# EAGLE design Callisto_Teknic_MSO_PBx4_v1p0 (EAGLE 9.6.2)
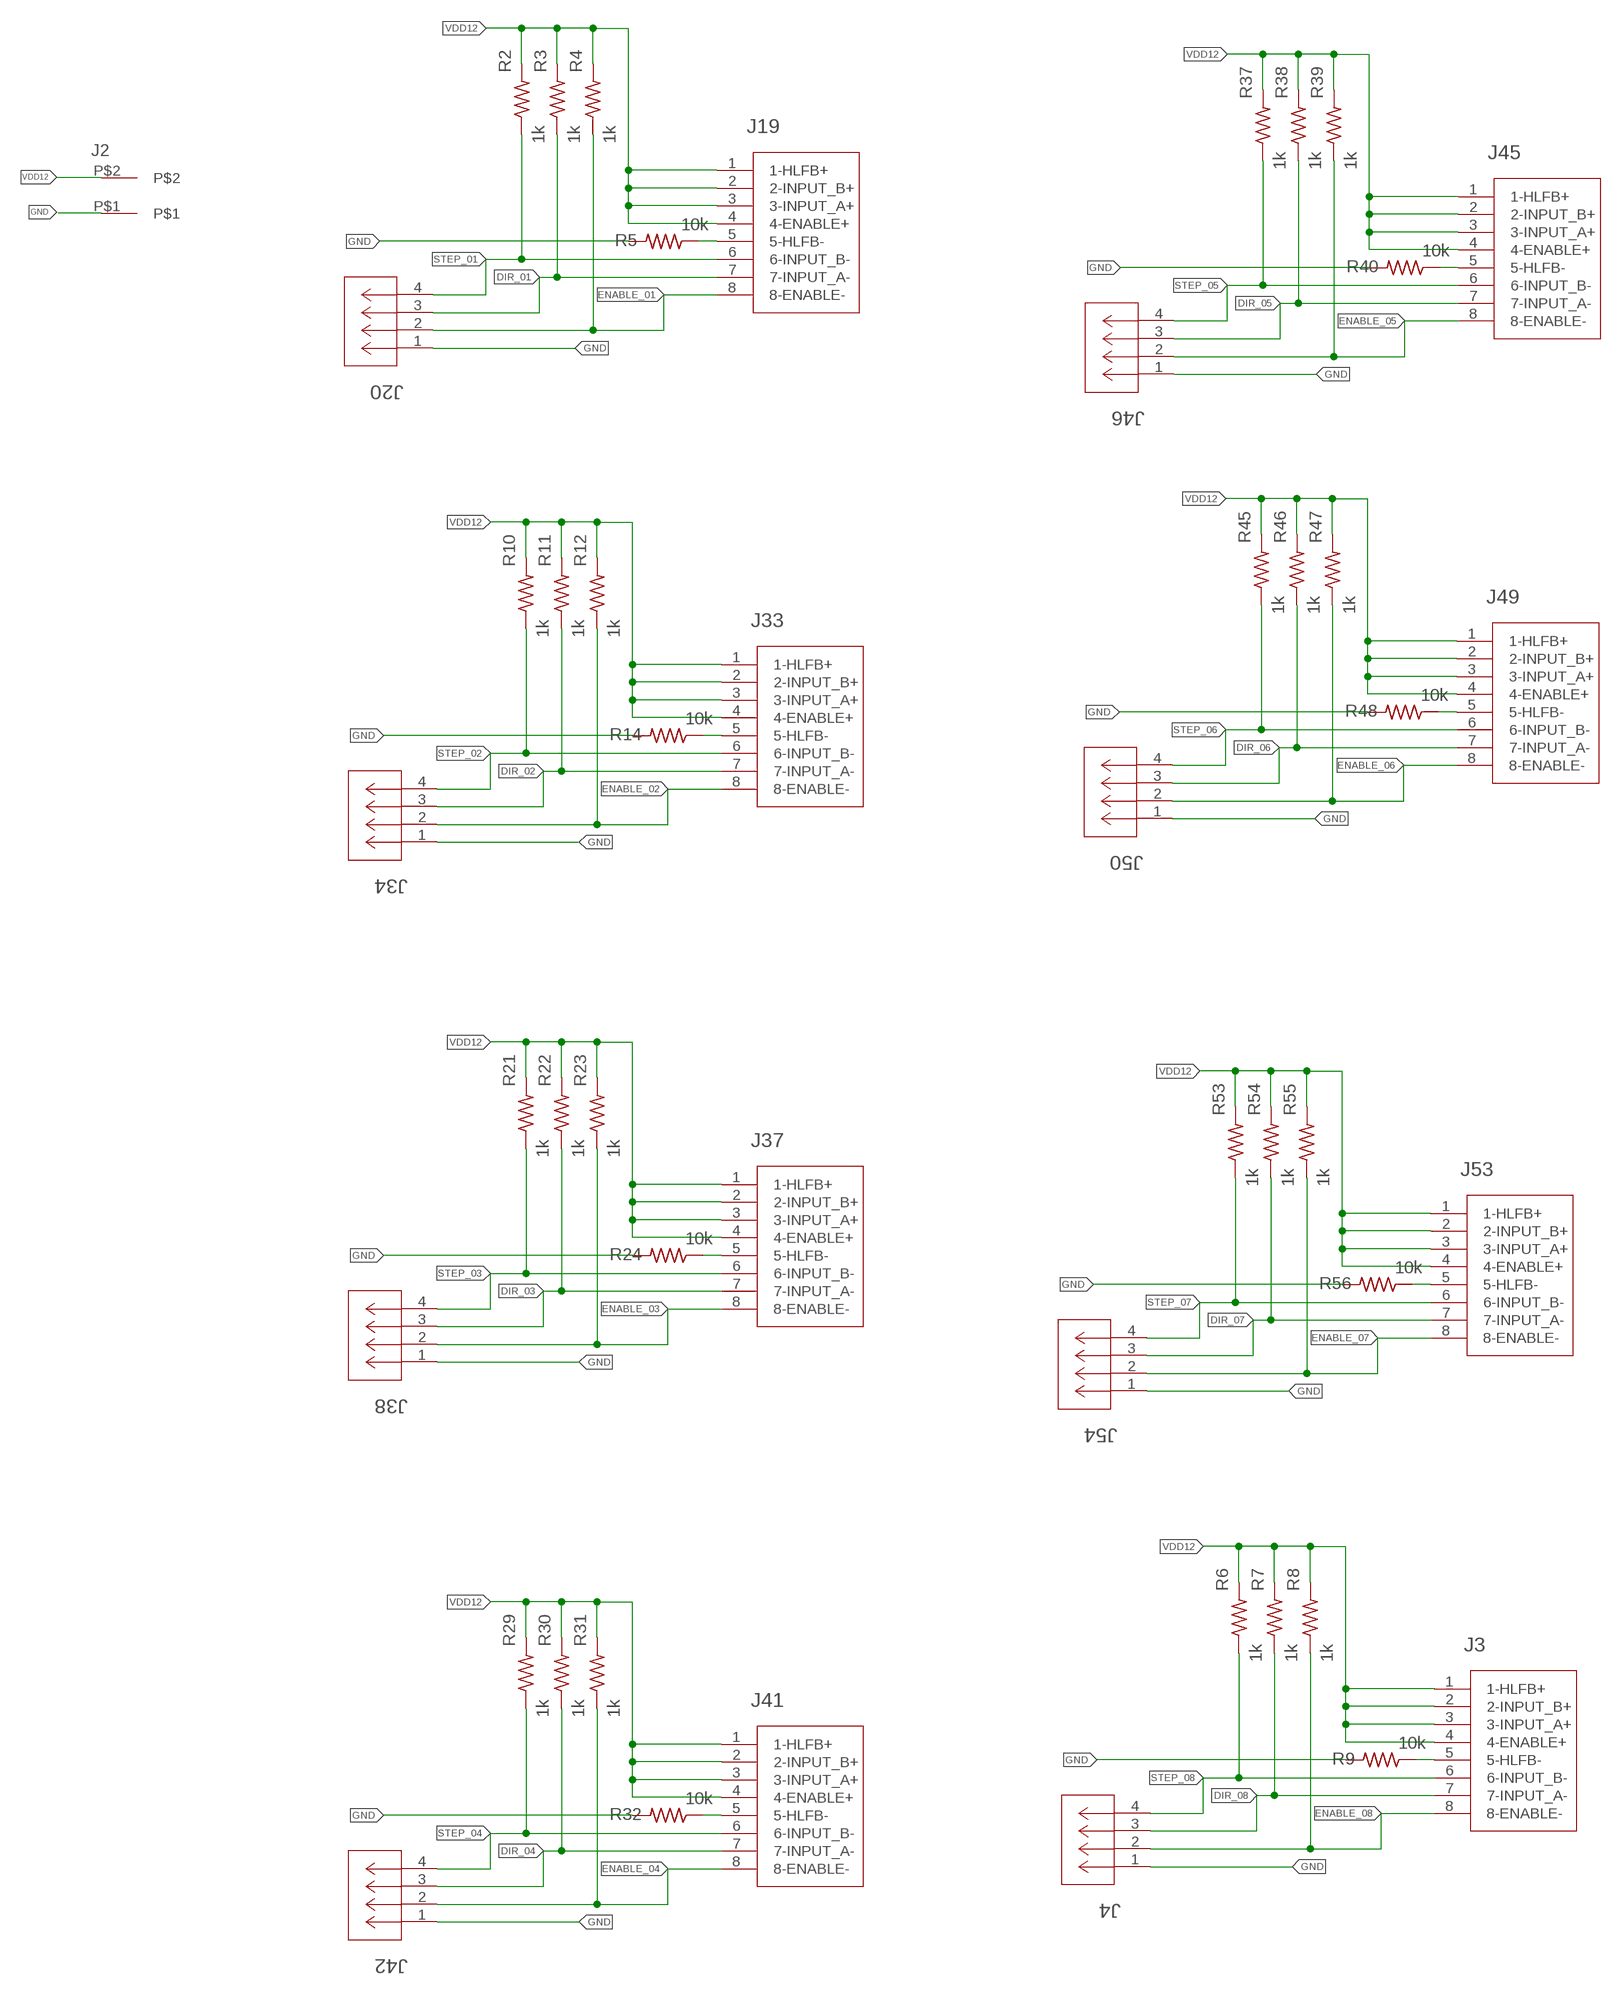
[diagram p0: schematic, sheet 1]

## Parts
J2  2-pos  3.81MM_1_X_2_RT_ANGLE_PLUG_HEADER  [2_3.81MM_PITCH]
J3  TEKNIC_8PIN_MOTOR  [CON_39281083]
J4  CONN_530470410_PICOBLADE_X_4  [CON_530470410_MOL]
J19  TEKNIC_8PIN_MOTOR  [CON_39281083]
J20  CONN_530470410_PICOBLADE_X_4  [CON_530470410_MOL]
J33  TEKNIC_8PIN_MOTOR  [CON_39281083]
J34  CONN_530470410_PICOBLADE_X_4  [CON_530470410_MOL]
J37  TEKNIC_8PIN_MOTOR  [CON_39281083]
J38  CONN_530470410_PICOBLADE_X_4  [CON_530470410_MOL]
J41  TEKNIC_8PIN_MOTOR  [CON_39281083]
J42  CONN_530470410_PICOBLADE_X_4  [CON_530470410_MOL]
J45  TEKNIC_8PIN_MOTOR  [CON_39281083]
J46  CONN_530470410_PICOBLADE_X_4  [CON_530470410_MOL]
J49  TEKNIC_8PIN_MOTOR  [CON_39281083]
J50  CONN_530470410_PICOBLADE_X_4  [CON_530470410_MOL]
J53  TEKNIC_8PIN_MOTOR  [CON_39281083]
J54  CONN_530470410_PICOBLADE_X_4  [CON_530470410_MOL]
R2  1k  R_0805  [0805]
R3  1k  R_0805  [0805]
R4  1k  R_0805  [0805]
R5  10k  R_0805  [0805]
R6  1k  R_0805  [0805]
R7  1k  R_0805  [0805]
R8  1k  R_0805  [0805]
R9  10k  R_0805  [0805]
R10  1k  R_0805  [0805]
R11  1k  R_0805  [0805]
R12  1k  R_0805  [0805]
R14  10k  R_0805  [0805]
R21  1k  R_0805  [0805]
R22  1k  R_0805  [0805]
R23  1k  R_0805  [0805]
R24  10k  R_0805  [0805]
R29  1k  R_0805  [0805]
R30  1k  R_0805  [0805]
R31  1k  R_0805  [0805]
R32  10k  R_0805  [0805]
R37  1k  R_0805  [0805]
R38  1k  R_0805  [0805]
R39  1k  R_0805  [0805]
R40  10k  R_0805  [0805]
R45  1k  R_0805  [0805]
R46  1k  R_0805  [0805]
R47  1k  R_0805  [0805]
R48  10k  R_0805  [0805]
R53  1k  R_0805  [0805]
R54  1k  R_0805  [0805]
R55  1k  R_0805  [0805]
R56  10k  R_0805  [0805]

## Nets
DIR_01: J19.7(7-INPUT_A-) J20.3 R3.1
DIR_02: J33.7(7-INPUT_A-) J34.3 R11.1
DIR_03: J37.7(7-INPUT_A-) J38.3 R22.1
DIR_04: J41.7(7-INPUT_A-) J42.3 R30.1
DIR_05: J45.7(7-INPUT_A-) J46.3 R38.1
DIR_06: J49.7(7-INPUT_A-) J50.3 R46.1
DIR_07: J53.7(7-INPUT_A-) J54.3 R54.1
DIR_08: J3.7(7-INPUT_A-) J4.3 R7.1
ENABLE_01: J19.8(8-ENABLE-) J20.2 R4.1
ENABLE_02: J33.8(8-ENABLE-) J34.2 R12.1
ENABLE_03: J37.8(8-ENABLE-) J38.2 R23.1
ENABLE_04: J41.8(8-ENABLE-) J42.2 R31.1
ENABLE_05: J45.8(8-ENABLE-) J46.2 R39.1
ENABLE_06: J49.8(8-ENABLE-) J50.2 R47.1
ENABLE_07: J53.8(8-ENABLE-) J54.2 R55.1
ENABLE_08: J3.8(8-ENABLE-) J4.2 R8.1
GND: J2.P$1 J4.1 J20.1 J34.1 J38.1 J42.1 J46.1 J50.1 J54.1 R5.2 R9.2 R14.2 R24.2 R32.2 R40.2 R48.2 R56.2
N$2: J19.5(5-HLFB-) R5.1
N$3: J3.5(5-HLFB-) R9.1
N$20: J33.5(5-HLFB-) R14.1
N$22: J37.5(5-HLFB-) R24.1
N$24: J41.5(5-HLFB-) R32.1
N$26: J45.5(5-HLFB-) R40.1
N$28: J49.5(5-HLFB-) R48.1
N$30: J53.5(5-HLFB-) R56.1
STEP_01: J19.6(6-INPUT_B-) J20.4 R2.1
STEP_02: J33.6(6-INPUT_B-) J34.4 R10.1
STEP_03: J37.6(6-INPUT_B-) J38.4 R21.1
STEP_04: J41.6(6-INPUT_B-) J42.4 R29.1
STEP_05: J45.6(6-INPUT_B-) J46.4 R37.1
STEP_06: J49.6(6-INPUT_B-) J50.4 R45.1
STEP_07: J53.6(6-INPUT_B-) J54.4 R53.1
STEP_08: J3.6(6-INPUT_B-) J4.4 R6.1
VDD12: J2.P$2 J3.1(1-HLFB+) J3.2(2-INPUT_B+) J3.3(3-INPUT_A+) J3.4(4-ENABLE+) J19.1(1-HLFB+) J19.2(2-INPUT_B+) J19.3(3-INPUT_A+) J19.4(4-ENABLE+) J33.1(1-HLFB+) J33.2(2-INPUT_B+) J33.3(3-INPUT_A+) J33.4(4-ENABLE+) J37.1(1-HLFB+) J37.2(2-INPUT_B+) J37.3(3-INPUT_A+) J37.4(4-ENABLE+) J41.1(1-HLFB+) J41.2(2-INPUT_B+) J41.3(3-INPUT_A+) J41.4(4-ENABLE+) J45.1(1-HLFB+) J45.2(2-INPUT_B+) J45.3(3-INPUT_A+) J45.4(4-ENABLE+) J49.1(1-HLFB+) J49.2(2-INPUT_B+) J49.3(3-INPUT_A+) J49.4(4-ENABLE+) J53.1(1-HLFB+) J53.2(2-INPUT_B+) J53.3(3-INPUT_A+) J53.4(4-ENABLE+) R2.2 R3.2 R4.2 R6.2 R7.2 R8.2 R10.2 R11.2 R12.2 R21.2 R22.2 R23.2 R29.2 R30.2 R31.2 R37.2 R38.2 R39.2 R45.2 R46.2 R47.2 R53.2 R54.2 R55.2

## Library data of the parts
J2 = 3D_MIG_Controller:3.81MM_1_X_2_RT_ANGLE_PLUG_HEADER: TERM BLOCK HDR 2POS 90DEG 3.81MM; PARTNO: 691322310002
J3 J19 J33 J37 J41 J45 J49 J53 = 3D_MIG_Controller:TEKNIC_8PIN_MOTOR; COPYRIGHT: Copyright (C) 2022 Ultra Librarian. All rights reserved.; MANUFACTURER_PART_NUMBER: 39281083; MFR_NAME: Molex Connector Corporation
J4 J20 J34 J38 J42 J46 J50 J54 = 3D_MIG_Controller:CONN_530470410_PICOBLADE_X_4; COPYRIGHT: Copyright (C) 2022 Ultra Librarian. All rights reserved.; MANUFACTURER_PART_NUMBER: 530470410; MFR_NAME: Molex Connector Corporation
R2-R12 R14 R21-R24 R29-R32 R37-R40 R45-R48 R53-R56 = 3D_MIG_Controller:R_0805

## Board
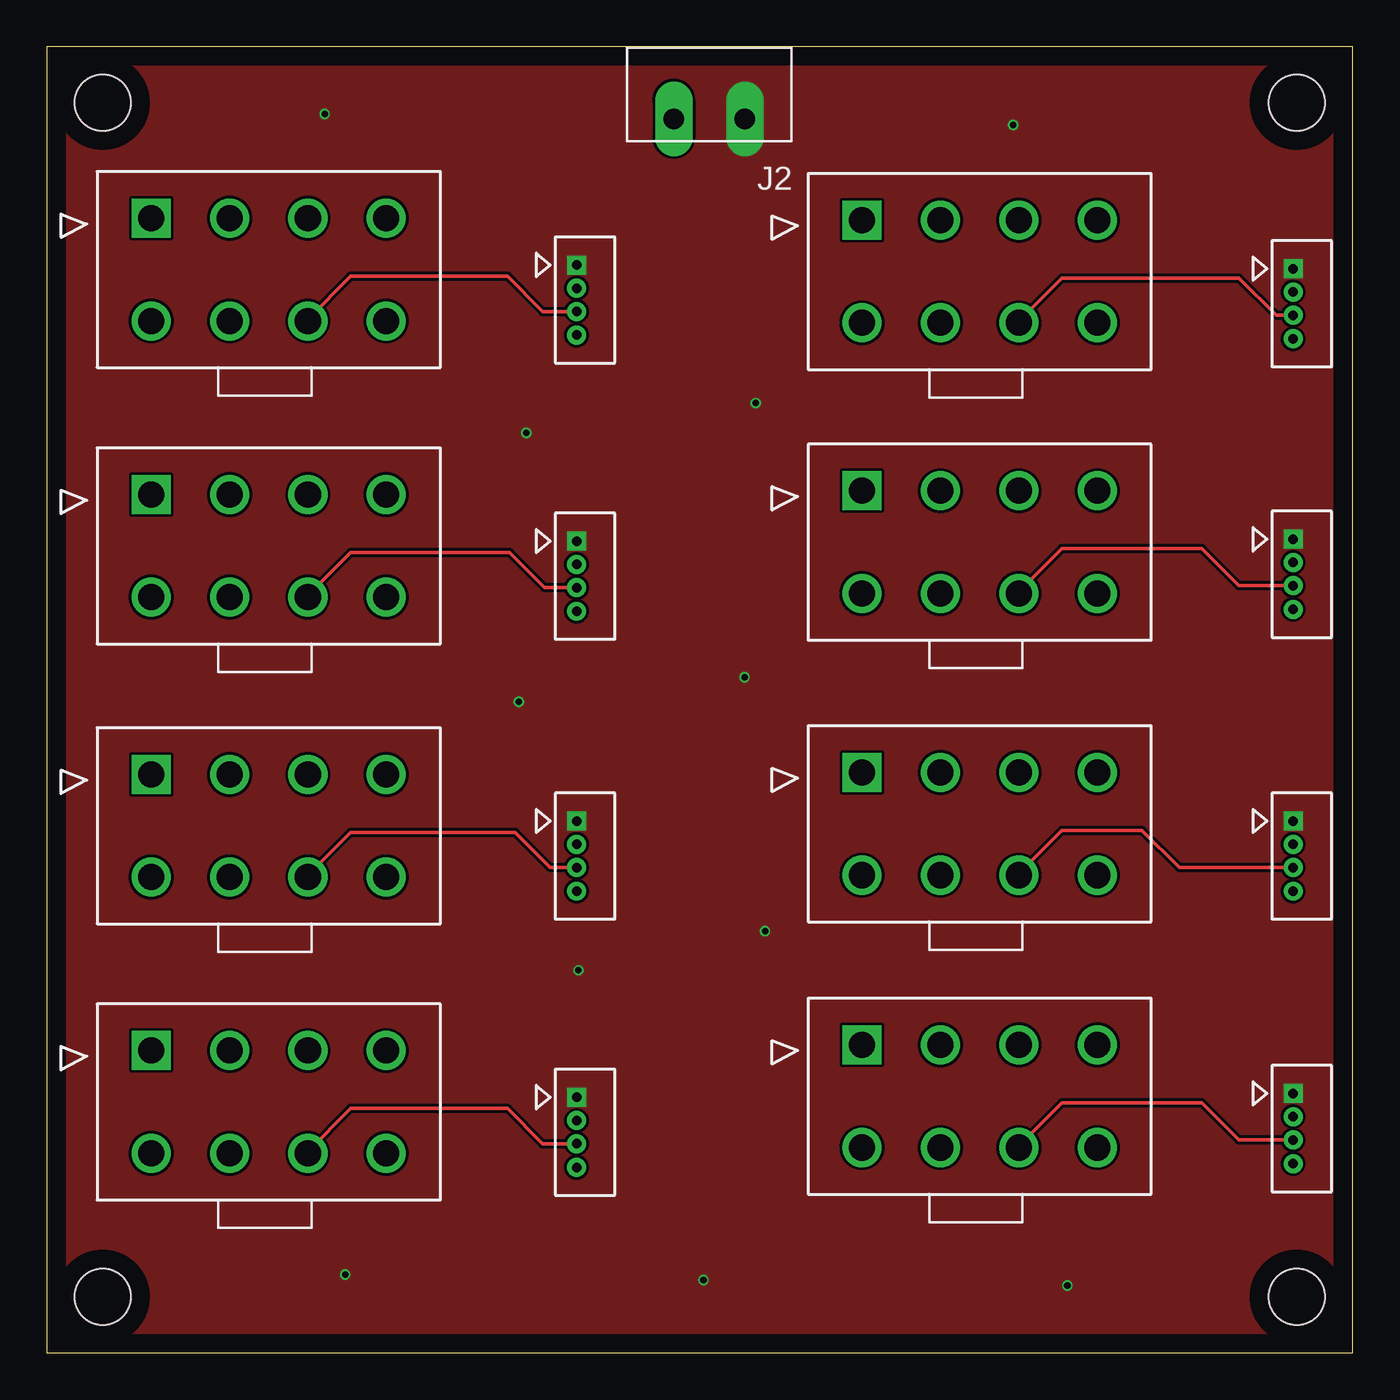
[diagram p1: board, top side]
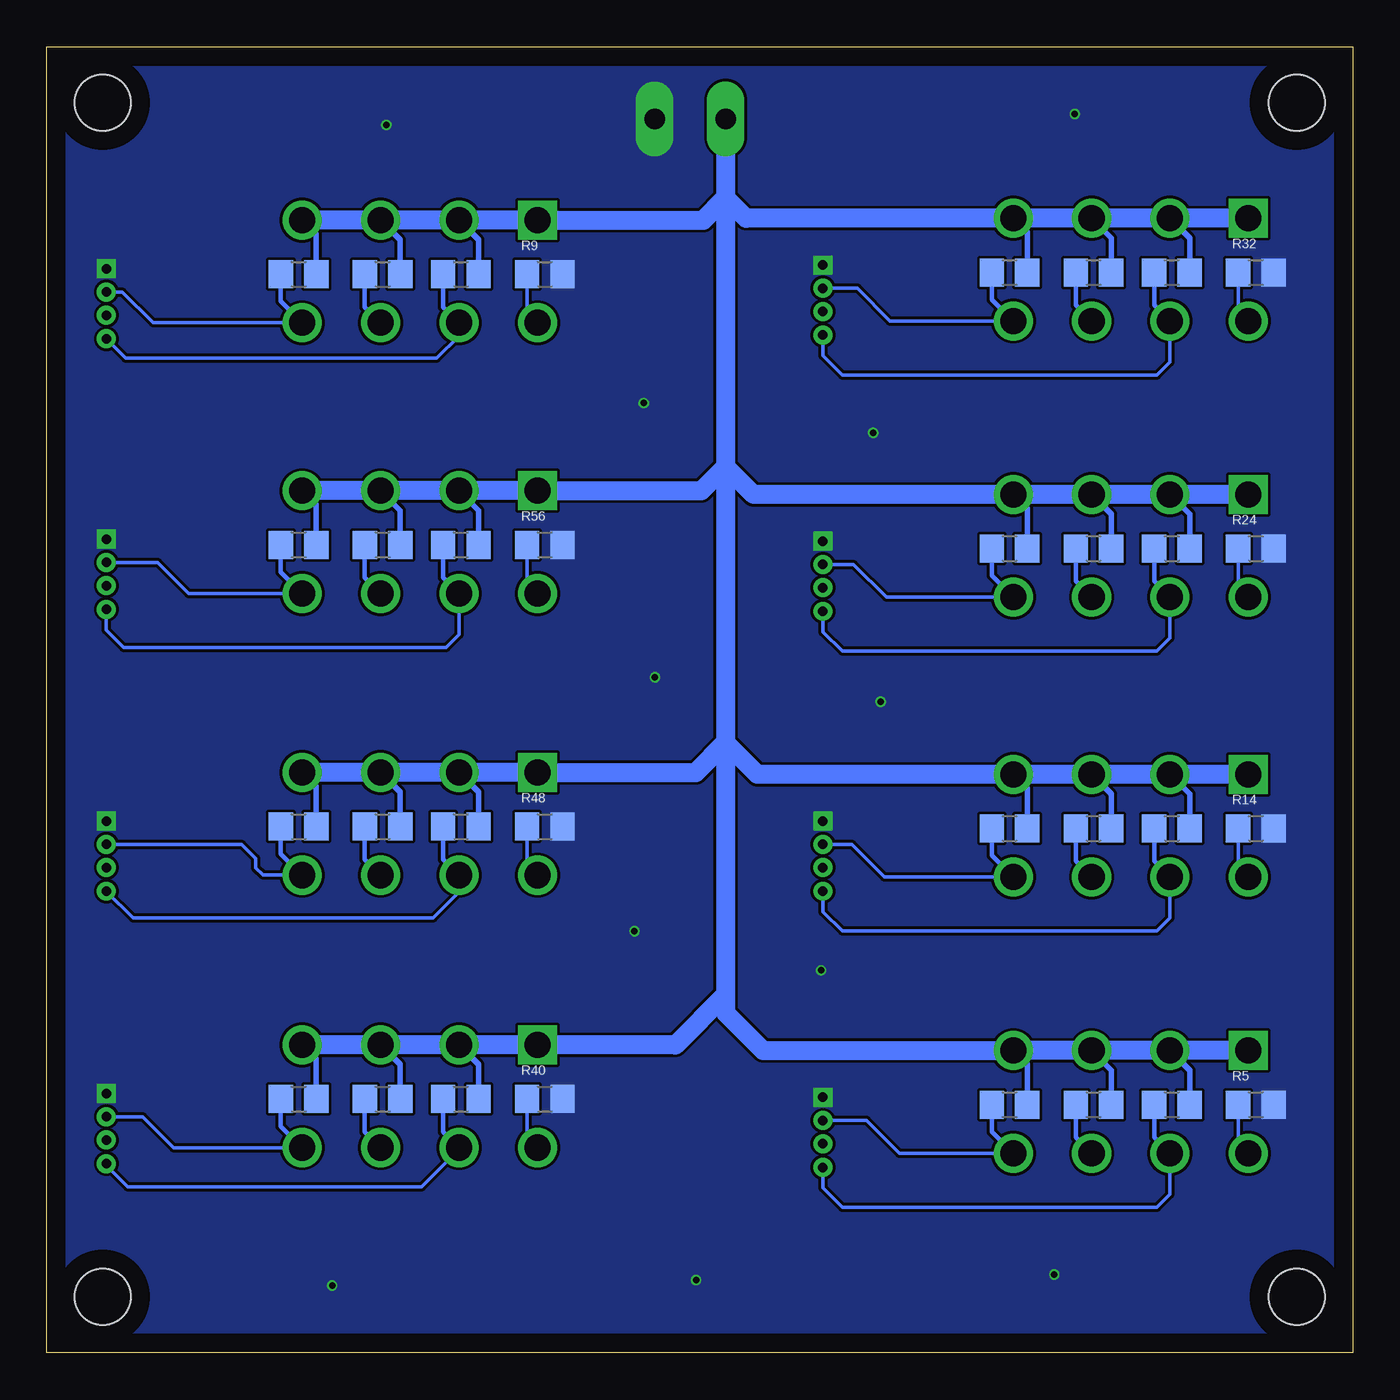
[diagram p2: board, bottom side, seen from below]

Size 70 x 70 mm. Coordinates in mm from the lower left corner, seen from the top.
Outline: 0,0 70,0 70,70 0,70 0,0
Copper layers (1*16): Top 0.035mm / dielectric 1.5mm / Bottom 0.035mm
Design rules "default": minimum track width 6mil, minimum drill 0.2mm, track to track 6mil, track to pad 6mil, pad to pad 6mil, via to via 6mil, smd to smd 6mil, copper to edge 40mil, drill to drill 6mil, minimum pad ring 10mil, minimum via ring 4mil, stop-mask expansion 4mil, vias tented up to drill 0mil, thermal gap 10mil
Holes 3 mm at 3,3 67,3 67,67 3,67

### Footprints (pad centres in the part's own frame; a part is rotated, then mirrored left to right if it is on the bottom)
2_3.81MM_PITCH = drill 1.1 pad 2 long: P$1 0,0; P$2 3.81,0
CON_39281083 = drill 1.397 pad 1.905 square: 1 12.6,-5.5 | drill 1.397 pad 1.905: 2 8.4,-5.5; 3 4.2,-5.5; 4 0,-5.5; 5 12.6,0; 6 8.4,0; 7 4.2,0; 8 0,0
CON_530470410_MOL = drill 0.508 pad 0.838 square: 1 0,0 | drill 0.508 pad 0.838: 2 -1.245,0; 3 -2.489,0; 4 -3.759,0
0805 = smd 1.3 x 1.5: 1 -0.95,0; 2 0.95,0

### Placement (x,y rotation side)
J2  37.42,66.13 180 top
J3  56.3,55.2 180 top
J4  66.8,58.1 90 top
J19  18.2,10.7 180 top
J20  28.4,13.7 90 top
J33  18.2,25.5 180 top
J34  28.4,28.5 90 top
J37  18.2,40.5 180 top
J38  28.4,43.5 90 top
J41  18.2,55.3 180 top
J42  28.4,58.3 90 top
J45  56.3,11 180 top
J46  66.8,13.9 90 top
J49  56.3,25.6 180 top
J50  66.8,28.5 90 top
J53  56.3,40.7 180 top
J54  66.8,43.6 90 top
R2  9.7,13.3 0 bottom
R3  13.9,13.3 0 bottom
R4  18.4,13.3 0 bottom
R5  5.2,13.3 0 bottom
R6  47.8,57.8 0 bottom
R7  52,57.8 0 bottom
R8  56.5,57.8 0 bottom
R9  43.3,57.8 0 bottom
R10  9.7,28.1 0 bottom
R11  13.9,28.1 0 bottom
R12  18.4,28.1 0 bottom
R14  5.2,28.1 0 bottom
R21  9.7,43.1 0 bottom
R22  13.9,43.1 0 bottom
R23  18.4,43.1 0 bottom
R24  5.2,43.1 0 bottom
R29  9.7,57.9 0 bottom
R30  13.9,57.9 0 bottom
R31  18.4,57.9 0 bottom
R32  5.2,57.9 0 bottom
R37  47.8,13.6 0 bottom
R38  52,13.6 0 bottom
R39  56.5,13.6 0 bottom
R40  43.3,13.6 0 bottom
R45  47.8,28.2 0 bottom
R46  52,28.2 0 bottom
R47  56.5,28.2 0 bottom
R48  43.3,28.2 0 bottom
R53  47.8,43.3 0 bottom
R54  52,43.3 0 bottom
R55  56.5,43.3 0 bottom
R56  43.3,43.3 0 bottom

### Tracks (layer width: path | path; a pad name or v marks a point on that pad's centre or on a via)
DIR_01
  Top 0.2: J20.3 26.59,11.21 24.7,13.1 16.3,13.1 14,10.8 J19.7
  Bottom 0.254: R3.1 14.85,11.55 J19.7
DIR_02
  Top 0.2: J34.3 26.99,26.01 25.1,27.9 16.3,27.9 14,25.6 J33.7
  Bottom 0.254: R11.1 14.85,26.35 J33.7
DIR_03
  Top 0.2: J38.3 26.69,41.01 24.8,42.9 16.3,42.9 14,40.6 J37.7
  Bottom 0.254: R22.1 14.85,41.35 J37.7
DIR_04
  Top 0.2: J42.3 26.59,55.81 24.7,57.7 16.3,57.7 14,55.4 J41.7
  Bottom 0.254: R30.1 14.85,56.15 J41.7
DIR_05
  Top 0.2: J46.3 63.89,11.41 61.9,13.4 54.4,13.4 52.1,11.1 J45.7
  Bottom 0.254: R38.1 52.95,11.85 J45.7
DIR_06
  Top 0.2: J50.3 60.69,26.01 58.7,28 54.4,28 52.1,25.7 J49.7
  Bottom 0.254: R46.1 52.95,26.45 J49.7
DIR_07
  Top 0.2: J54.3 63.89,41.11 61.9,43.1 54.4,43.1 52.1,40.8 J53.7
  Bottom 0.254: R54.1 52.95,41.55 J53.7
DIR_08
  Top 0.2: J4.3 65.89,55.61 63.9,57.6 54.4,57.6 52.1,55.3 J3.7
  Bottom 0.254: R7.1 52.95,56.05 J3.7
ENABLE_01
  Bottom 0.2: J20.2 26.05,12.46 24.3,10.7 J19.8
  Bottom 0.254: R4.1 19.35,11.85 J19.8
ENABLE_02
  Bottom 0.2: J34.2 26.86,27.25 25.1,25.5 J33.8
  Bottom 0.254: R12.1 19.35,26.65 J33.8
ENABLE_03
  Bottom 0.2: J38.2 26.75,42.26 25,40.5 J37.8
  Bottom 0.254: R23.1 19.35,41.65 J37.8
ENABLE_04
  Bottom 0.2: J42.2 26.55,57.05 24.8,55.3 J41.8
  Bottom 0.254: R31.1 19.35,56.45 J41.8
ENABLE_05
  Bottom 0.2: J46.2 64.86,12.65 63.2,11 J45.8
  Bottom 0.254: R39.1 57.45,12.15 J45.8
ENABLE_06
  Bottom 0.2: J50.2 59.55,27.25 58.8,26.5 58.8,26 58.4,25.6 J49.8
  Bottom 0.254: R47.1 57.45,26.75 J49.8
ENABLE_07
  Bottom 0.2: J54.2 64.06,42.35 62.4,40.7 J53.8
  Bottom 0.254: R55.1 57.45,41.85 J53.8
ENABLE_08
  Bottom 0.2: J4.2 65.95,56.85 64.3,55.2 J3.8
  Bottom 0.254: R8.1 57.45,56.35 J3.8
GND  (via drill 0.35)
  other vias: 16,4.2 35.2,3.9 54.7,3.6 28.5,20.5 38.5,22.6 25.3,34.9 37.4,36.2 25.7,49.3 38,50.9 14.9,66.4 51.8,65.8
  pour Bottom (no thermals): 0,70 70,70 70,0 0,0
  pour Top (no thermals): 0,70.1 70,70.1 70,0 0,0
N$2
  Bottom 0.2: J19.5 6.15,11.25 R5.1
N$3
  Bottom 0.2: J3.5 44.25,55.75 R9.1
N$20
  Bottom 0.2: J33.5 6.15,26.05 R14.1
N$22
  Bottom 0.2: J37.5 6.15,41.05 R24.1
N$24
  Bottom 0.2: J41.5 6.15,55.85 R32.1
N$26
  Bottom 0.2: J45.5 44.25,11.55 R40.1
N$28
  Bottom 0.2: J49.5 44.25,26.15 R48.1
N$30
  Bottom 0.2: J53.5 44.25,41.25 R56.1
STEP_01
  Bottom 0.2: J20.4 28.4,8.84 27.36,7.8 10.5,7.8 9.8,8.5 J19.6
  Bottom 0.254: R2.1 10.65,11.55 J19.6
STEP_02
  Bottom 0.2: J34.4 28.4,23.64 27.36,22.6 10.5,22.6 9.8,23.3 J33.6
  Bottom 0.254: R10.1 10.65,26.35 J33.6
STEP_03
  Bottom 0.2: J38.4 28.4,38.64 27.36,37.6 10.5,37.6 9.8,38.3 J37.6
  Bottom 0.254: R21.1 10.65,41.35 J37.6
STEP_04
  Bottom 0.2: J42.4 28.4,53.44 27.36,52.4 10.5,52.4 9.8,53.1 J41.6
  Bottom 0.254: R29.1 10.65,56.15 J41.6
STEP_05
  Bottom 0.2: J46.4 66.8,10.04 65.66,8.9 49.9,8.9 47.9,10.9 J45.6
  Bottom 0.254: R37.1 48.75,11.85 J45.6
STEP_06
  Bottom 0.2: J50.4 65.36,23.3 49.3,23.3 47.9,24.7 J49.6
  Bottom 0.254: R45.1 48.75,26.45 J49.6
STEP_07
  Bottom 0.2: J54.4 66.8,38.74 65.86,37.8 48.6,37.8 47.9,38.5 J53.6
  Bottom 0.254: R53.1 48.75,41.55 J53.6
STEP_08
  Bottom 0.2: J4.4 65.76,53.3 49.1,53.3 47.9,54.5 J3.6
  Bottom 0.254: R6.1 48.75,56.05 J3.6
VDD12
  Bottom 0.305: R2.2 8.75,15.15 J19.2 | R3.2 12.95,15.15 J19.3 | R4.2 17.45,15.45 J19.4 | R10.2 8.75,29.95 J33.2 | R11.2 12.95,29.95 J33.3 | R12.2 17.45,30.25 J33.4 | R21.2 8.75,44.95 J37.2 | R22.2 12.95,44.95 J37.3 | R23.2 17.45,45.25 J37.4 | R29.2 8.75,59.75 J41.2 | R30.2 12.95,59.75 J41.3 | R31.2 17.45,60.05 J41.4 | R37.2 46.85,15.45 J45.2 | R38.2 51.05,15.45 J45.3 | R39.2 55.55,15.75 J45.4 | R45.2 46.85,30.05 J49.2 | R46.2 51.05,30.05 J49.3 | R47.2 55.55,30.35 J49.4 | R53.2 46.85,45.15 J53.2 | R54.2 51.05,45.15 J53.3 | R55.2 55.55,45.45 J53.4 | R6.2 46.85,59.65 J3.2 | R7.2 51.05,59.65 J3.3 | R8.2 55.55,59.95 J3.4
  Bottom 1.016: J19.1 J19.2 J19.3 J19.4 31.6,16.2 33.61,18.21 33.61,19.2 | J33.1 J33.2 J33.3 J33.4 31.91,31 33.61,32.7 | J37.1 J37.2 J37.3 J37.4 32.11,46 33.61,47.5 | J41.1 J41.2 J41.3 J41.4 32.51,60.8 33.61,61.9 | J45.4 J45.3 J45.2 J45.1 36.31,16.5 33.61,19.2 | J49.4 J49.3 J49.2 J49.1 35.21,31.1 33.61,32.7 | J53.4 J53.3 J53.2 J53.1 34.91,46.2 33.61,47.5 | J2.P$2 33.61,61.9 | 33.61,61.9 33.61,47.5 | 33.61,47.5 33.61,32.7 | 33.61,32.7 33.61,19.2 | J3.4 J3.3 J3.2 J3.1 34.81,60.7 33.61,61.9